# EasyEDA schematic VEX_Competition_Switch_Solo.json
TITLE: Sheet_2; REV: 1.0; Date: 2025-08-22; Sheet: 1/1; Drawn By: noozabooz; Company: Your Company
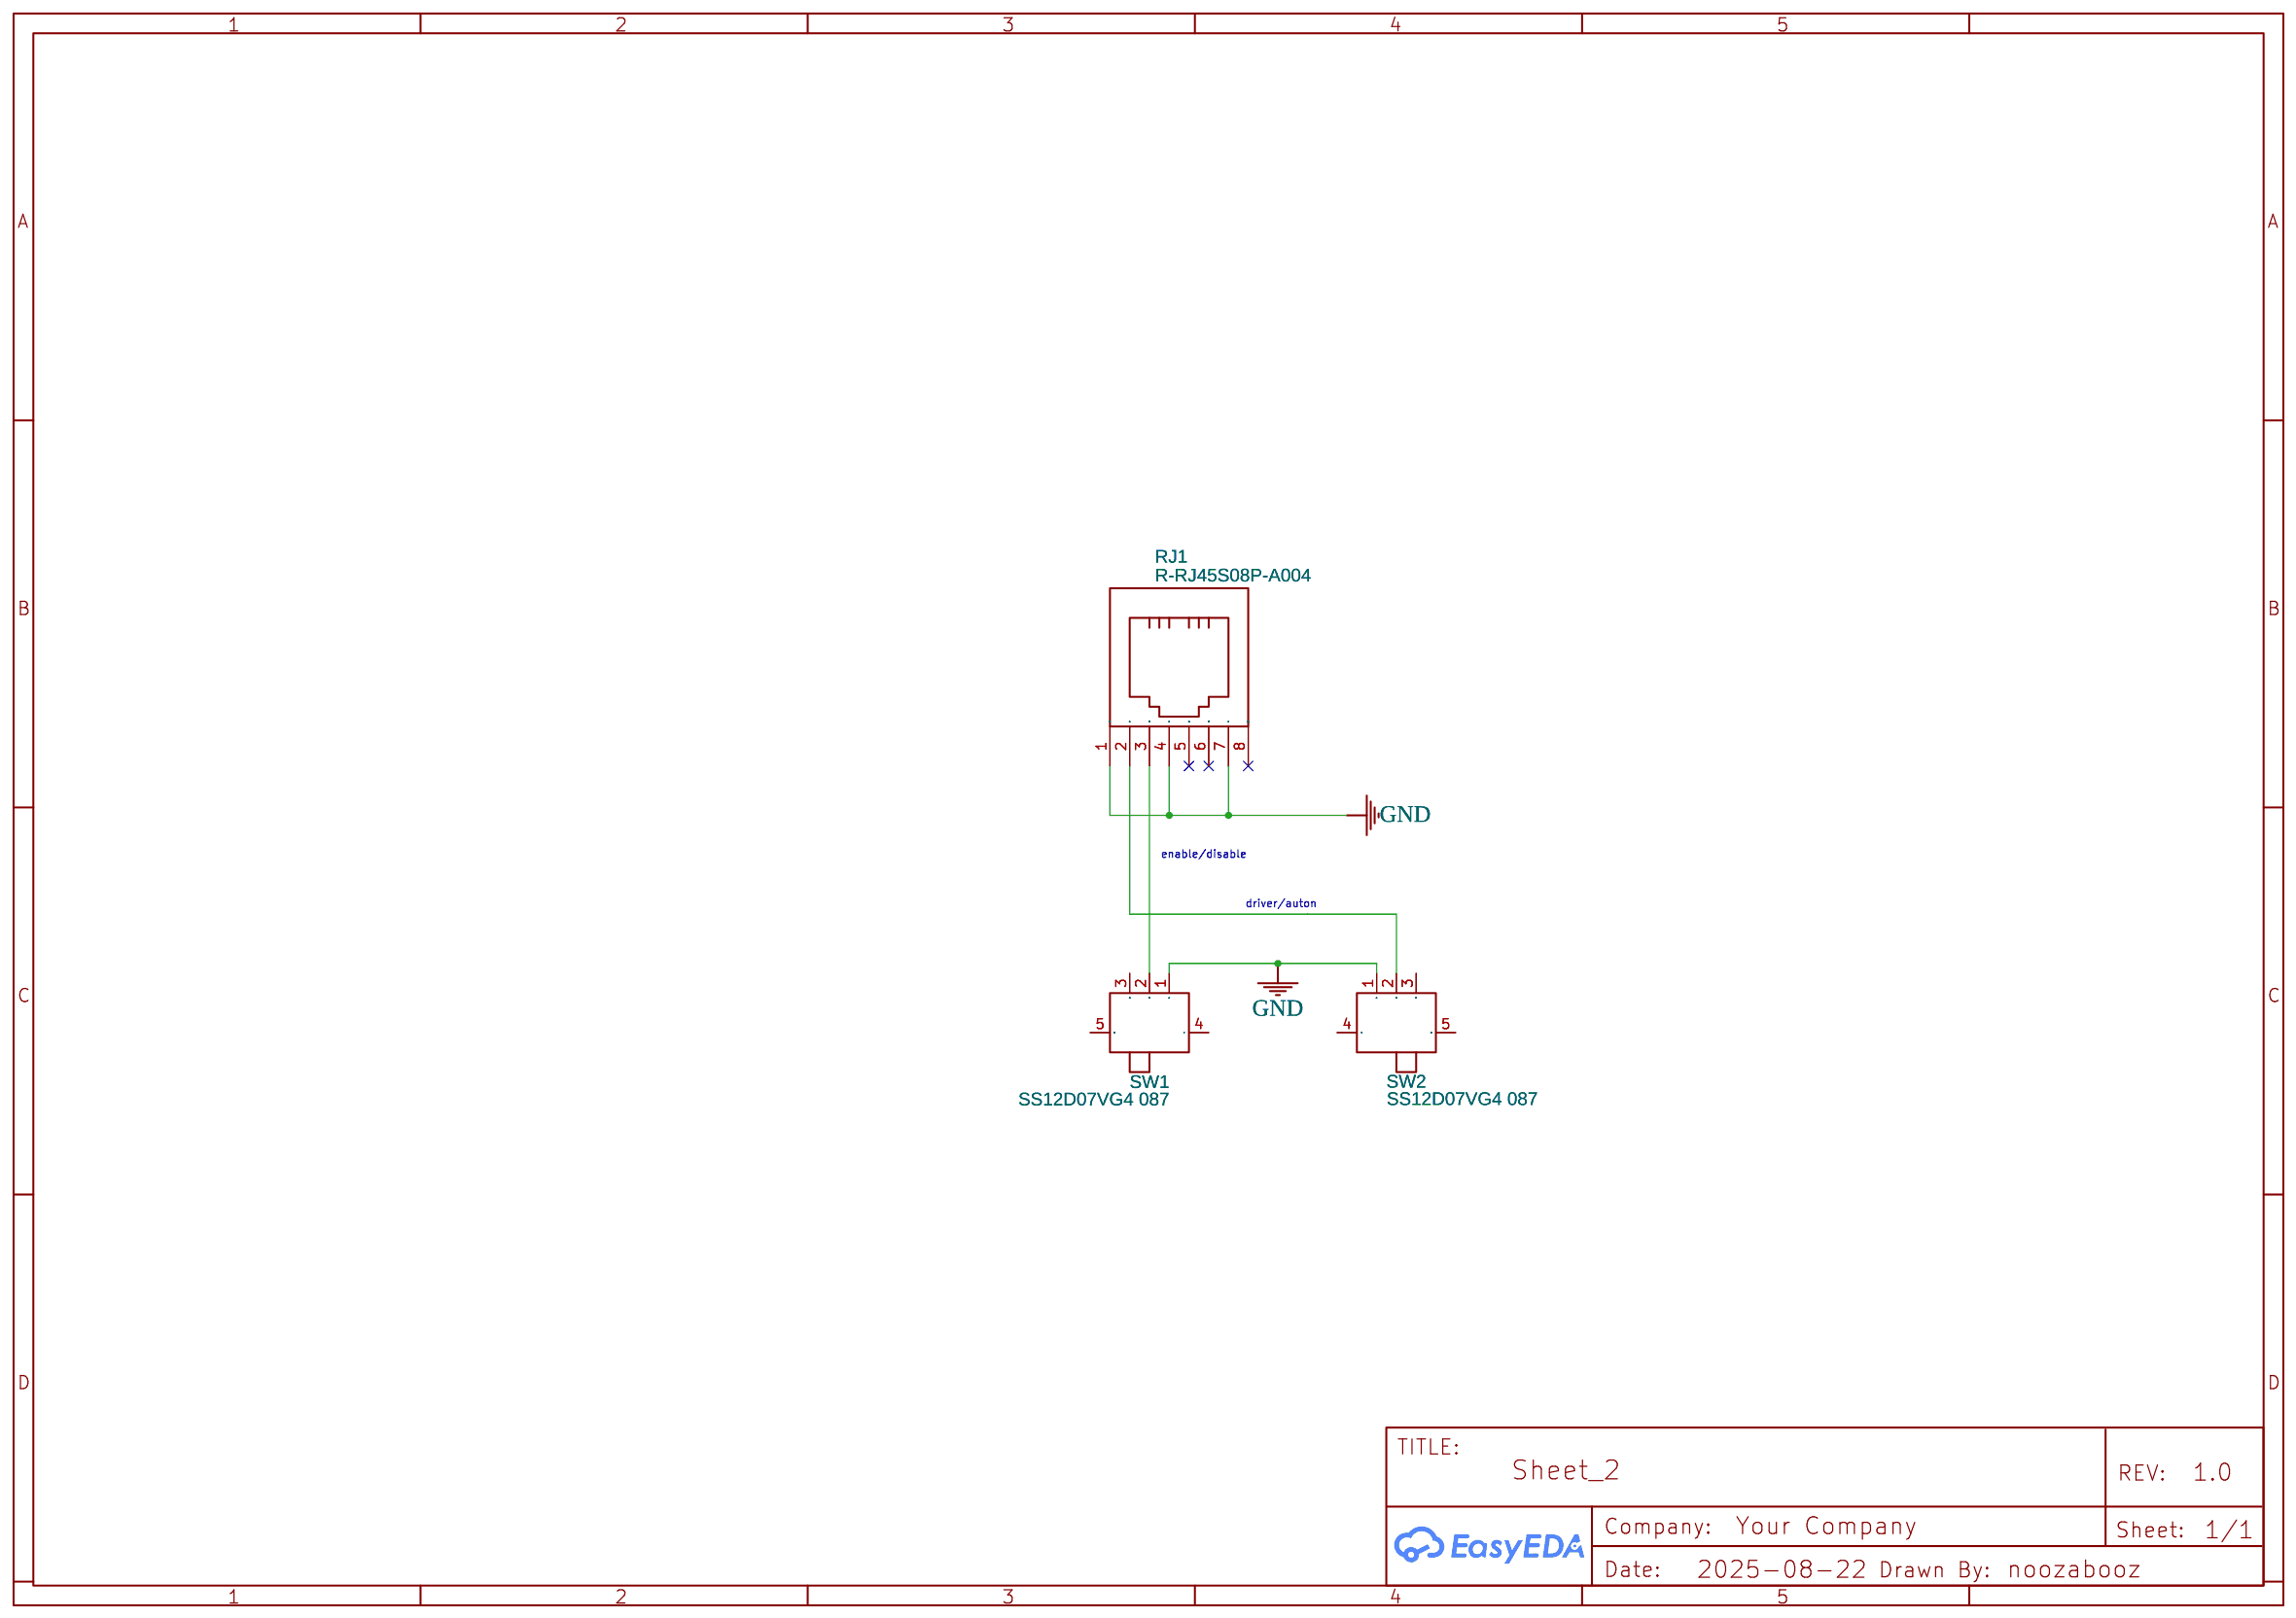
[diagram p0: schematic sheet]

## Parts
RJ1  R-RJ45S08P-A004  [RJ45-TH_CKMTW_R-RJ45S08P-A004]
SW1  SS12D07VG4 087  [SW-TH_SS12D07VG4]
SW2  SS12D07VG4 087  [SW-TH_SS12D07VG4]

## Library data of the parts
RJ1 = R-RJ45S08P-A004: Contributor: LCSC; Supplier: LCSC; Supplier Part: C2902702; Manufacturer: Ckmtw(灿科盟); JLCPCB Part Class: Extended Part
SW1 SW2 = SS12D07VG4 087: Contributor: LCSC; Supplier: LCSC; Supplier Part: C2939726; Manufacturer: SHOU HAN(首韩); JLCPCB Part Class: Extended Part

## Nets
GND: RJ1.1 RJ1.4 RJ1.7 SW1.1 SW2.1
Net-(RJ1-2): RJ1.2 SW2.2
Net-(RJ1-3): RJ1.3 SW1.2

Not connected (* = marked no-connect by the designer): RJ1 5* 6* 8*; SW1 3 4 5; SW2 3 4 5

## Notes on the sheet
- enable/disable
- driver/auton
